# Altium schematic sheet Alarmy.SchDoc
size A; SheetNumber: 1; SheetTotal: 1
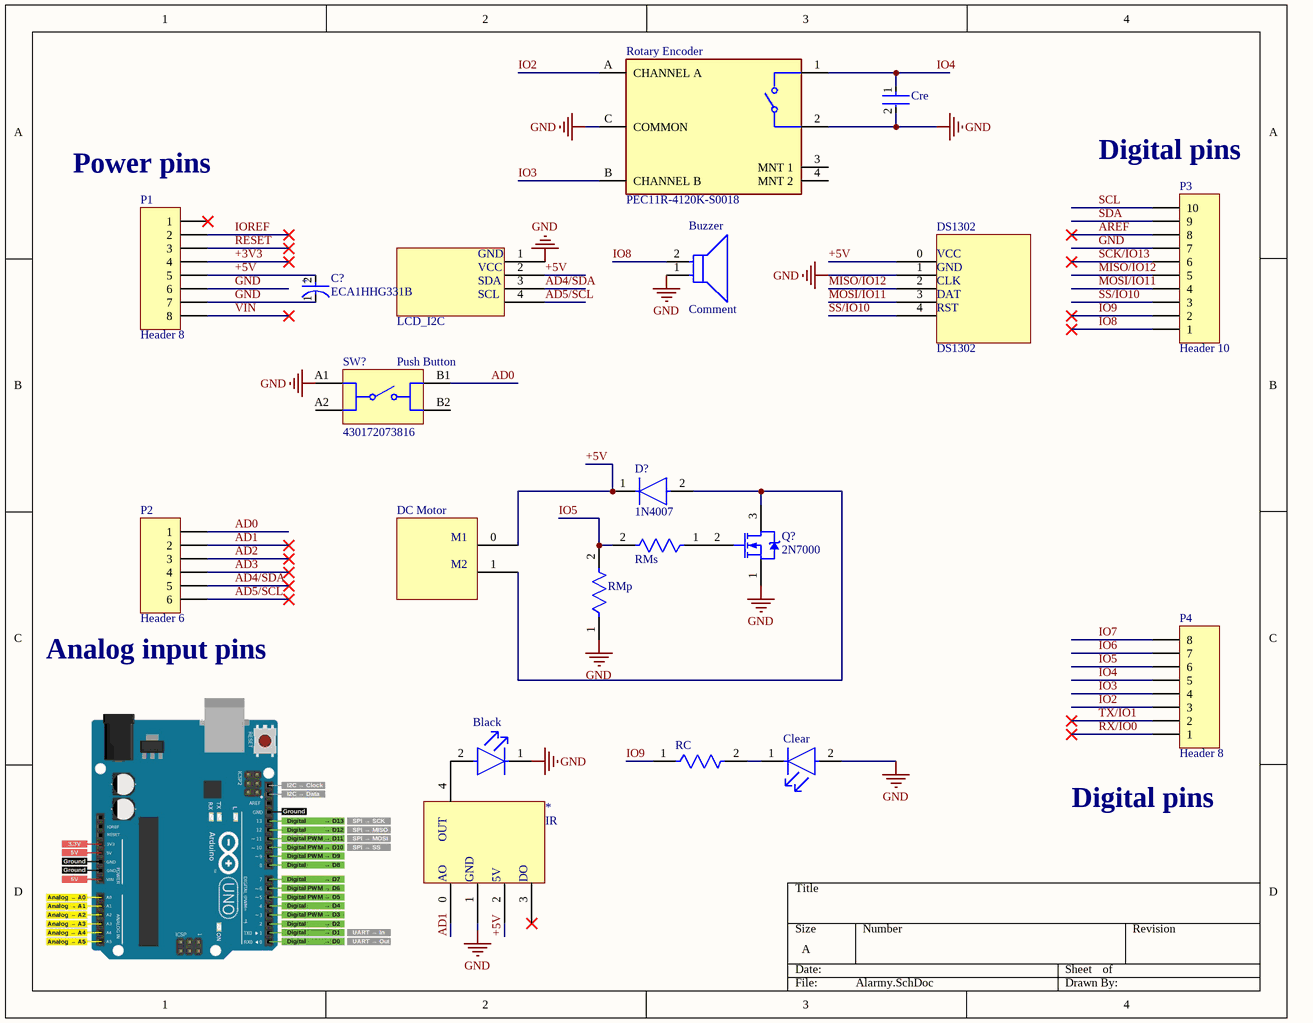
[diagram p0: Alarmy.SchDoc]

## Parts
*  IR  [CustomIR]
Black  TLLG4400-AS12  [FP-6_544-5255_01-4-MFG]  (value not drawn)
Buzzer  Comment  [FP-SD1614T5-A1-MFG]
C?  ECA1HHG331B  [FP-RAD-TH-D_10_0_5-L_16_1-MFG]
Clear  TLLG4400-AS12  [FP-6_544-5255_01-4-MFG]  (value not drawn)
Cre  RDER71H105K2K1H03B  [FP-RDE2M1-MFG]  (value not drawn)
D?  1N4007  [FP-1N4007-MFG]
DC_Motor  DC Motor  [Motor]  (value not drawn)
DS1302  DS1302  [DS1302]
LCD  LCD_I2C  [LCD_I2C]
P1  Header 8  [HDR1X8]
P2  Header 6  [HDR1X6]
P3  Header 10  [HDR1X10]
P4  Header 8  [HDR1X8]
Q?  2N7000  [ONSC-TO-92-3-29-11]
RC  ZOR-25-R-52-0R  [FP-ZOR-25-R-52-0R-MFG]  (value not drawn)
RMp  ZOR-25-R-52-0R  [FP-ZOR-25-R-52-0R-MFG]  (value not drawn)
RMs  ZOR-25-R-52-0R  [FP-ZOR-25-R-52-0R-MFG]  (value not drawn)
Rotary_Encoder  PEC11R-4120K-S0018  [FP-PEC11R-4120K-S0018-MFG]
SW?  430172073816  [430172073816]

## Nets
GND: *.1(GND) Black.1(C) Buzzer.1 C?.1(C) Clear.2(A) Cre.2 DS1302.1(GND) LCD.1(GND) P1.6 P1.7 P3.7 Q?.1(S) RMp.1 Rotary_Encoder.2 Rotary_Encoder.C(COMMON) SW?.A1
+3V3: P1.4
+5V: *.2(+) C?.2(A) D?.1(C) DC_Motor.0(M1) DS1302.0(VCC) LCD.2(VCC) P1.5
AD0: P2.1 SW?.B1
AD1: *.0(AOut) P2.2
AD2: P2.3
AD3: P2.4
AD4/SDA: LCD.3(SDA) P2.5
AD5/SCL: LCD.4(SCL) P2.6
AREF: P3.8
IO2: P4.3 Rotary_Encoder.A(CHANNEL_A)
IO3: P4.4 Rotary_Encoder.B(CHANNEL_B)
IO4: Cre.1 P4.5 Rotary_Encoder.1
IO5: P4.6 RMp.2 RMs.2
IO6: P4.7
IO7: P4.8
IO8: Buzzer.2 P3.1
IO9: P3.2 RC.1
IOREF: P1.2
MISO/IO12: DS1302.2(CLK) P3.5
MOSI/IO11: DS1302.3(DAT) P3.4
RESET: P1.3
RX/IO0: P4.1
SCK/IO13: P3.6
SCL: P3.10
SDA: P3.9
SS/IO10: DS1302.4(RST) P3.3
TX/IO1: P4.2
VIN: P1.8
Net*_4: *.4(COMP) Black.2(A)
NetClear_1: Clear.1(C) RC.2
NetD?_2: D?.2(A) DC_Motor.1(M2) Q?.3(D)
NetQ?_2: Q?.2(G) RMs.1

Not connected (* = marked no-connect by the designer): * 3(DO)*; P1 1*; Rotary_Encoder 3(MNT_1) 4(MNT_2); SW? A2 B2

## Notes on the sheet
- (near P3) Digital pins
- (near P1) Power pins
- (near SW?) Push Button
- (near P2) Analog input pins
- (near P4) Digital pins
- (in symbol CMP-05427-000698-1) +
- (in symbol IR) OUT; AO; 5V

## Library data of the parts
* = IR: pin to pad: 0>AO 1>GND 2>5V 3>DO 4>OUT
Black Clear = CMP-02520-000017-1: LED GREEN DIFFUSED T-1 T/H; Number of Elements: 1; Forward Voltage: 2.4V; Luminous Intensity: 2mcd; Reverse Voltage: 20V; Power Dissipation: 20mW; Dominant Wavelength: 575nm; Forward Current: 7mA; Viewing Angle: 50°; Test Current: 2mA; Number of Pins: 2; Lens Style: Diffused; Color: Green; Case/Package: T; Depth: 3.2mm; Length: 3.2mm; Number of LEDs: 1; Mount: Through Hole; Radiation Hardening: No; Max Operating Temperature: 100°C; RoHS Compliant: No; Min Operating Temperature: -40°C; Packaging: Tape and Reel
Buzzer = CMP-08413-000002-1: AUDIO PIEZO TRANSDUCER 30V TH; Voltage Rating: 3V; Washable: No; Frequency: 4kHz; Package Quantity: 1500; Packaging: Bulk; Lead Free: Lead Free; Diameter: 17mm; Series: PS; Height: 7.5mm; Max Operating Temperature: 70°C; Mount: Through Hole; Min Operating Temperature: -10°C; Operating Supply Voltage: 3V; Termination: PC Pins; RoHS Compliant: Yes
C? = CMP-05427-000698-1: Aluminum Electrolytic Capacitors (Radial Lead Type) AEC-Q200 Qualified 330uF ±20% 50V; Life (Hours): 2000Hour; Ripple Current: 410mA; Lead Diameter: 0.6mm; Lead/Base Style: Straight; Diameter: 10mm; Termination: Radial; Length: 16mm; Construction: RADIAL; Lead Pitch: 5mm; Mount: Through Hole; Max Operating Temperature: 105°C; Package Quantity: 500; Packaging: Ammo Pack; Voltage Rating (DC): 50V; Contact Plating: Tin; Min Operating Temperature: -55°C; Capacitance: 330uF; Height: 16mm; Series: NHG; Tolerance: 20%; RoHS Compliant: Yes; Case/Package: Radial; Radiation Hardening: No
Cre = CMP-06035-050824-1: Ceramic Capacitor 1uF ±10% 50V X7R Radial; Lead/Base Style: Kinked; Lead Diameter: 0.5mm; Voltage Rating (DC): 50V; Lead Free: Lead Free; Max Operating Temperature: 125°C; Min Operating Temperature: -55°C; Package Quantity: 500; Height - Seated (Max): 0.236inch; Tolerance: 10%; Height: 4mm; Mount: Through Hole; Lead Pitch: 0.197inch; Capacitance: 1uF; Width: 0.124inch; Voltage Rating: 50V; Dielectric: X7R; Termination: Radial; Resistor Type: Ceramic; Packaging: Bulk; Length: 0.217inch; Case/Package: Radial
D? = CMP-123542-000001-1: Rectifier diode 1000 V 1 A DO-41, ,; Manufacturer: Diotec; Max Surge Forward Current: 27A; Forward Current: 1A; Max Junction Temp: +175°C; Reverse Voltage: 1000V; Value: 15pF; Peak Reverse Current: 5uA; Category: Diode; Temperature Range Low: -50°C; Automotive: No; Temperature: -50°C to +175°C; Lead Free: Yes; ComponentLink2Description: Datasheet; Max Repetitive Reverse Voltage: 1000V; ComponentLink2URL: https://datasheet.octopart.com/1N4007-Diotec-datasheet-62346875.pdf; Manufacturer Part Number: 1N4007; Device Class L3: Rectifier Diodes; Height: 2.8mm; Octopart: https://octopart.com/1n4007-diotec-4040411; Package: 1N4007; Temperature Range High: +175°C; Device Class L1: Discrete Semiconductors; Device Class L2: Diodes; RoHS: TRUE; Capacitance: 15pF; Ipc Land Pattern Name: DIOAD888W100L520D280
DC_Motor = DC Motor: pin to pad: 0>M1 1>M2
DS1302 = DS1302: pin to pad: 0>VCC 1>GND 2>CLK 3>DAT 4>RST
LCD = LCD_I2C: pin to pad: 1>GND 2>VCC 3>SDA 4>SCL
P1 P4 = Header 8: Header, 8-Pin; LatestRevisionDate: 17-Jul-2002; LatestRevisionNote: Re-released for DXP Platform.; Publisher: Altium Limited
P2 = Header 6: Header, 6-Pin; LatestRevisionDate: 17-Jul-2002; LatestRevisionNote: Re-released for DXP Platform.; Publisher: Altium Limited
P3 = Header 10: Header, 10-Pin; LatestRevisionDate: 17-Jul-2002; LatestRevisionNote: Re-released for DXP Platform.; Publisher: Altium Limited
Q? = CMP-1058-00936-1: Small Signal MOSFET, 200 mA, 60 V, N-Channel, 3-Pin TO-92, Bulk Box; Manufacturer: On Semiconductor; Ciss Typ (pF): 60; VGS(th) Max (V): 3; Crss Typ (pF): 5; Channel Polarity: N Channel; VGS Max (V): 20; Configuration: Single; PD Max (W): 0.35; Coss Typ (pF): 25; ID Max (A): 0.2; PackageVersion: Rev. AM; ComponentLink3URL: http://www.onsemi.cn/pub_link/Collateral/2N6426-D.PDF; ComponentLink2URL: http://www.onsemi.com/pub_link/Collateral/2N7000-D.PDF; DatasheetVersion: Rev. 8; Mounting Technology: Through Hole; V(BR)DSS Min (V): 60; PartNumber: 2N7000; PackageDescription: 3-Pin Transistor Outline, Body 4.825 x 3.685 mm, Pitch 1.27 mm; ComponentLink2Description: Datasheet; ComponentLink1URL: http://www.onsemi.com/; PackageReference: TO-92-3-29-11_AM_SL; Packing: Bulk Box; ComponentLink1Description: Manufacturer URL; Package Type: TO-92; ComponentLink3Description: Package Specification
RC RMp RMs = CMP-03413-000010-1: RES 0 OHM JUMPER 1/4W AXIAL; Temperature Coefficient: 100ppm/°C; Max Power Dissipation: 250mW; Tolerance: 5%; Resistance: 0mR; Case/Package: Axial; Termination: Axial; Series: ZOR; Lead Free: Lead Free; Length: 0.248inch; Military Standard: Not; RoHS Compliant: Yes; Min Operating Temperature: -55°C; Packaging: Tape and Reel; Resistor Type: Carbon Film; Construction: Cylindrical; Package Quantity: 5000; Max Operating Temperature: 155°C; Number of Terminations: 2; Power Rating: 250mW
Rotary_Encoder = CMP-07421-000027-1: ROTARY ENCODER MECHANICAL 18PPR; Number of Channels: 2; Hole Diameter: 1.8mm; Pulses per Revolution: 18; Output Type: Quadrature; Built in Switch: Yes; Packaging: Bulk; Mount: Through Hole; REACH SVHC: No SVHC; Orientation: Vertical; Termination: PC Pin; RoHS Compliant: Yes; Height: 13.4mm; Package Quantity: 75; Length: 26.5mm; Encoder Type: Mechanical; Min Operating Temperature: -30°C; Width: 12.5mm; Max Operating Temperature: 70°C; Detent: Yes
SW? = CMP-03913-99472338-4: Tactile Switch, 0.05A, 12Vdc, 160Gf, Smd Rohs Compliant: Yes; Current Rating: 50mA; Insulation Resistance: 100MΩ; Voltage Rating: 12V; RoHS: Compliant; Min Operating Temperature: -40°C; Height: 7.3mm; Max Operating Temperature: 85°C; Contact Plating: Silver; Packaging: Tape and Reel